# EAGLE schematic nixie2 (EAGLE 6.5.0)
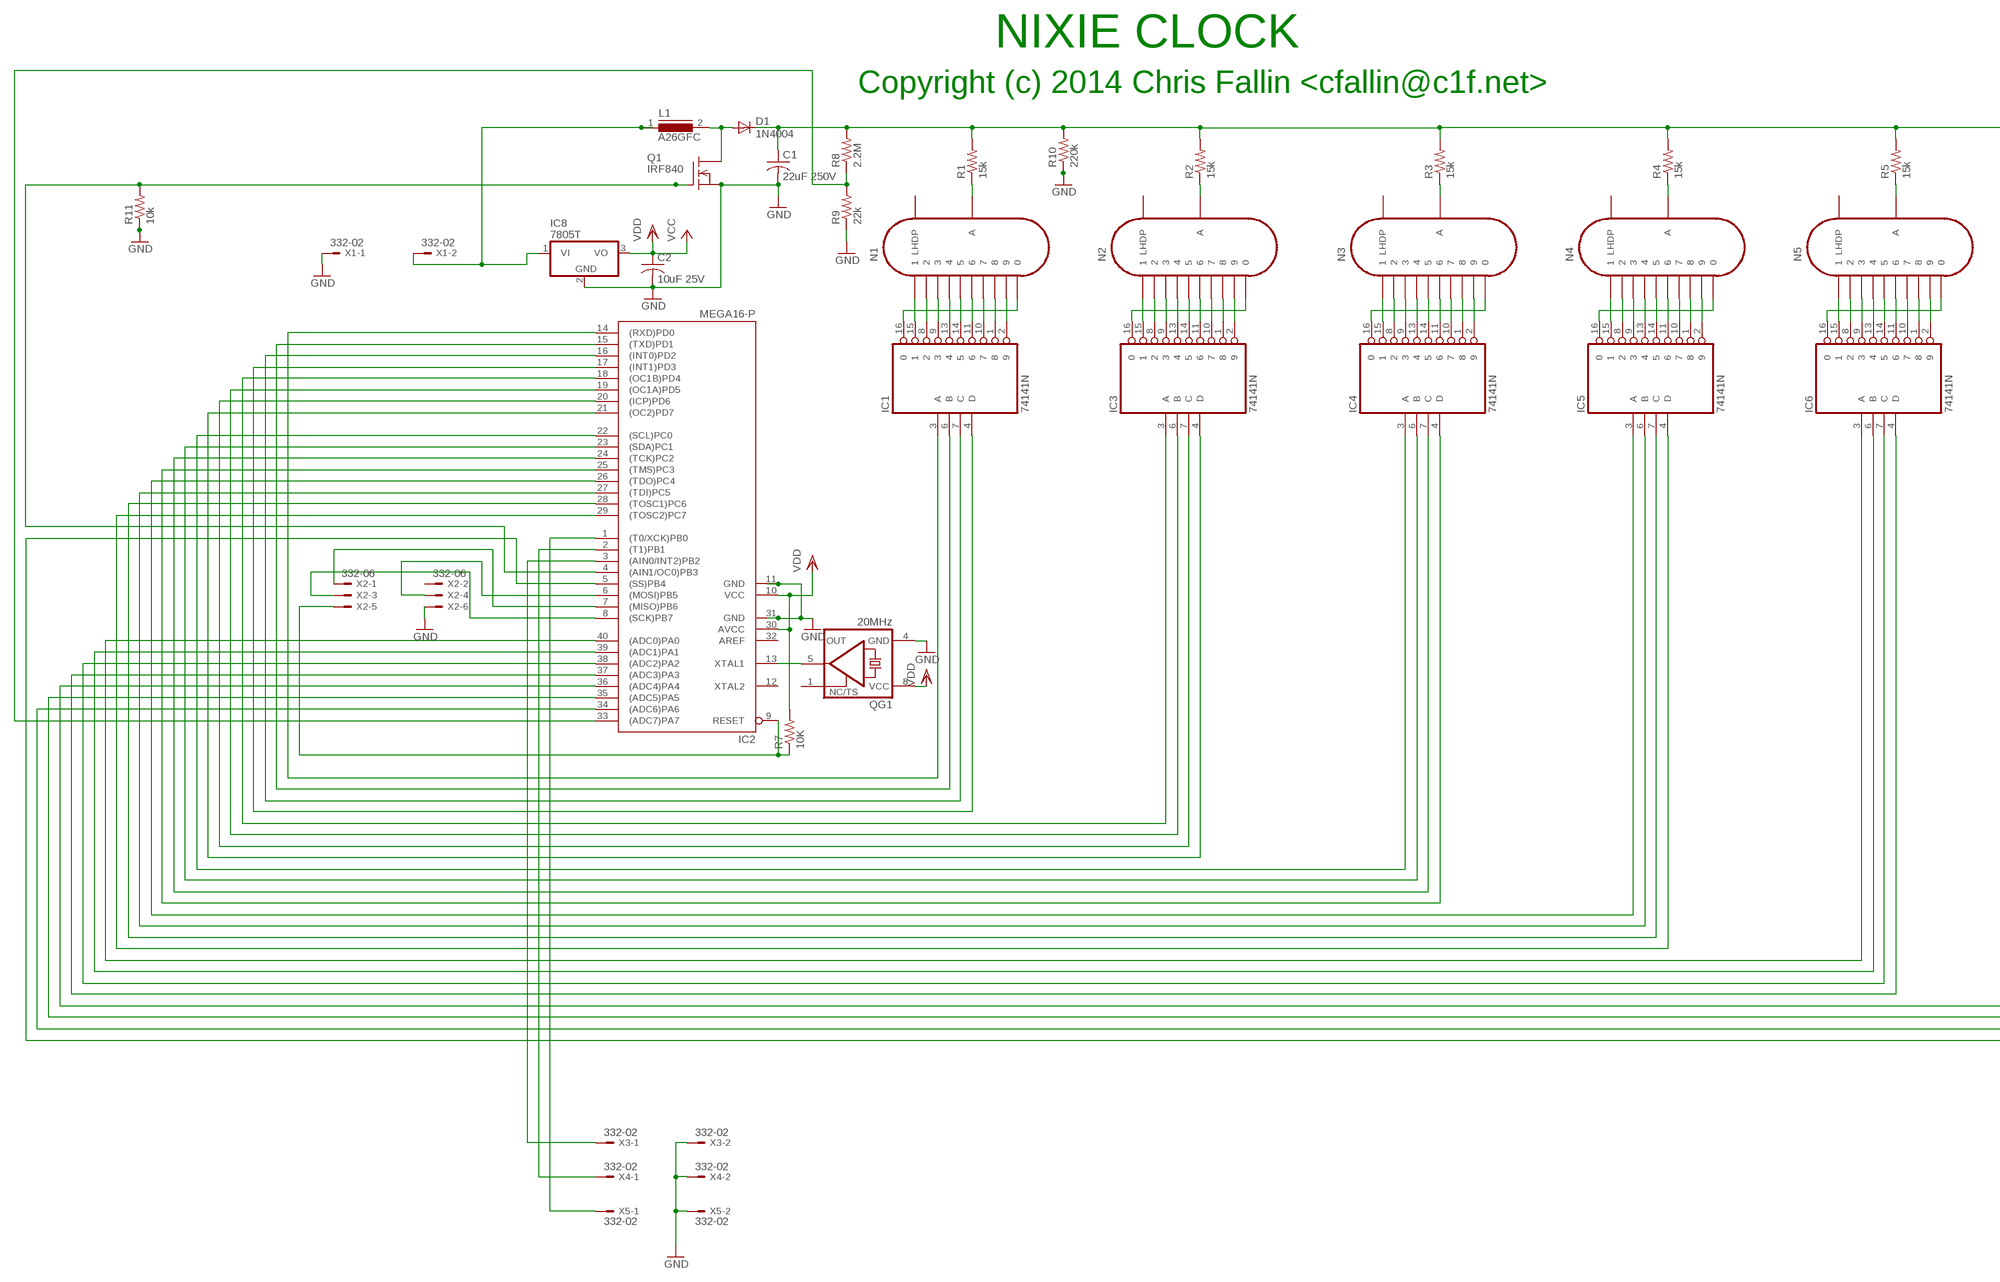
[diagram p0: schematic, sheet 1, part 1 of 2]
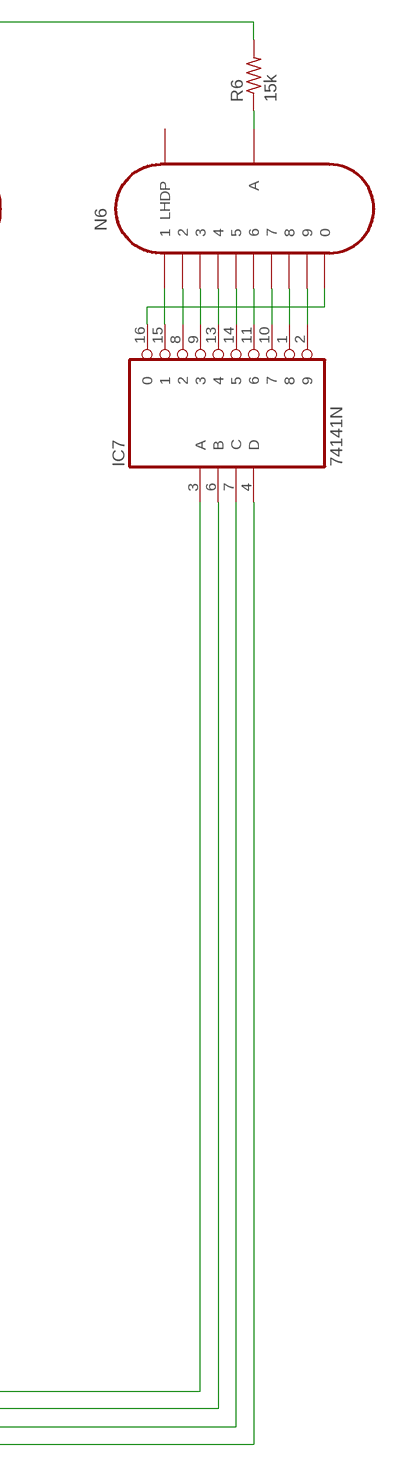
[diagram p1: schematic, sheet 1, part 2 of 2]

## Parts
C1  22uF 250V  C-US050-075X075  [C050-075X075]
C2  10uF 25V  C-US050-075X075  [C050-075X075]
D1  1N4004  [DO41-10]
IC1  74141N  [DIL16]
IC2  MEGA16-P  [DIL40]
IC3  74141N  [DIL16]
IC4  74141N  [DIL16]
IC5  74141N  [DIL16]
IC6  74141N  [DIL16]
IC7  74141N  [DIL16]
IC8  7805T  [TO220H]
L1  A26GFC  [A26GFC]
N1  IN-12B  [IN-12]
N2  IN-12B  [IN-12]
N3  IN-12B  [IN-12]
N4  IN-12B  [IN-12]
N5  IN-12B  [IN-12]
N6  IN-12B  [IN-12]
Q1  IRF840  [TO220]
QG1  20MHz  XO-8  [DIL08S]
R1  15k  R-US_0204/2V  [0204V]
R2  15k  R-US_0204/2V  [0204V]
R3  15k  R-US_0204/2V  [0204V]
R4  15k  R-US_0204/2V  [0204V]
R5  15k  R-US_0204/2V  [0204V]
R6  15k  R-US_0204/2V  [0204V]
R7  10K  R-US_0204/2V  [0204V]
R8  2.2M  R-US_0204/2V  [0204V]
R9  22k  R-US_0204/2V  [0204V]
R10  220k  R-US_0204/2V  [0204V]
R11  10k  R-US_0204/2V  [0204V]
X1  332-02  [332-02]
X2  332-06  [332-06]
X3  332-02  [332-02]
X4  332-02  [332-02]
X5  332-02  [332-02]

## Nets
GND: C1.2 C2.2 IC2.11(GND) IC2.31(GND) IC8.2(GND) Q1.3(S) QG1.4(GND) R9.1 R10.1 R11.1 X1.1 X2.6 X3.2 X4.2 X5.2
N$1: IC1.15 N1.1
N$2: IC1.8 N1.2
N$3: IC1.9 N1.3
N$4: IC1.13 N1.4
N$5: IC1.14 N1.5
N$6: IC1.11 N1.6
N$7: IC1.10 N1.7
N$8: IC1.1 N1.8
N$9: IC1.2 N1.9
N$11: N1.A R1.1
N$12: IC3.15 N2.1
N$13: IC3.8 N2.2
N$14: IC3.9 N2.3
N$15: IC3.13 N2.4
N$16: IC3.14 N2.5
N$17: IC3.11 N2.6
N$18: IC3.10 N2.7
N$19: IC3.1 N2.8
N$20: IC3.2 N2.9
N$21: IC3.16 N2.0
N$22: N2.A R2.1
N$23: IC4.15 N3.1
N$24: IC4.8 N3.2
N$25: IC4.9 N3.3
N$26: IC4.13 N3.4
N$27: IC4.14 N3.5
N$28: IC4.11 N3.6
N$29: IC4.10 N3.7
N$30: IC4.1 N3.8
N$31: IC4.2 N3.9
N$32: IC4.16 N3.0
N$33: N3.A R3.1
N$34: IC5.15 N4.1
N$35: IC5.8 N4.2
N$36: IC5.9 N4.3
N$37: IC5.13 N4.4
N$38: IC5.14 N4.5
N$39: IC5.11 N4.6
N$40: IC5.10 N4.7
N$41: IC5.1 N4.8
N$42: IC5.2 N4.9
N$43: IC5.16 N4.0
N$44: N4.A R4.1
N$45: IC6.15 N5.1
N$46: IC6.8 N5.2
N$47: IC6.9 N5.3
N$48: IC6.13 N5.4
N$49: IC6.14 N5.5
N$50: IC6.11 N5.6
N$51: IC6.10 N5.7
N$52: IC6.1 N5.8
N$53: IC6.2 N5.9
N$54: IC6.16 N5.0
N$55: N5.A R5.1
N$56: IC7.15 N6.1
N$57: IC7.8 N6.2
N$58: IC7.9 N6.3
N$59: IC7.13 N6.4
N$60: IC7.14 N6.5
N$61: IC7.11 N6.6
N$62: IC7.10 N6.7
N$63: IC7.1 N6.8
N$64: IC7.2 N6.9
N$65: IC7.16 N6.0
N$66: N6.A R6.1
N$67: C1.1 D1.C R1.2 R2.2 R3.2 R4.2 R5.2 R6.2 R8.2 R10.2
N$68: IC2.13(XTAL1) QG1.5(OUT)
N$69: IC2.6((MOSI)PB5) X2.4
N$70: D1.A L1.2 Q1.2(D)
N$71: IC8.1(VI) L1.1 X1.2
N$72: IC2.7((MISO)PB6) X2.1
N$73: IC2.8((SCK)PB7) X2.3
N$74: IC2.9(RESET) R7.1 X2.5
N$75: IC1.3(A) IC2.14((RXD)PD0)
N$76: IC1.6(B) IC2.15((TXD)PD1)
N$77: IC1.7(C) IC2.16((INT0)PD2)
N$78: IC1.4(D) IC2.17((INT1)PD3)
N$79: IC2.18((OC1B)PD4) IC3.3(A)
N$80: IC2.19((OC1A)PD5) IC3.6(B)
N$81: IC2.20((ICP)PD6) IC3.7(C)
N$82: IC2.21((OC2)PD7) IC3.4(D)
N$83: IC2.22((SCL)PC0) IC4.3(A)
N$84: IC2.23((SDA)PC1) IC4.6(B)
N$85: IC2.24((TCK)PC2) IC4.7(C)
N$86: IC2.25((TMS)PC3) IC4.4(D)
N$87: IC2.26((TDO)PC4) IC5.3(A)
N$88: IC2.27((TDI)PC5) IC5.6(B)
N$89: IC2.28((TOSC1)PC6) IC5.7(C)
N$90: IC2.29((TOSC2)PC7) IC5.4(D)
N$91: IC2.4((AIN1/OC0)PB3) Q1.1(G) R11.2
N$92: IC2.40((ADC0)PA0) IC6.3(A)
N$93: IC2.39((ADC1)PA1) IC6.6(B)
N$94: IC2.38((ADC2)PA2) IC6.7(C)
N$95: IC2.37((ADC3)PA3) IC6.4(D)
N$96: IC2.36((ADC4)PA4) IC7.3(A)
N$97: IC2.35((ADC5)PA5) IC7.6(B)
N$98: IC2.34((ADC6)PA6) IC7.7(C)
N$99: IC2.5((SS)PB4) IC7.4(D)
N$100: IC2.33((ADC7)PA7) R8.1 R9.2
N$101: IC2.3((AIN0/INT2)PB2) X3.1
N$102: IC2.2((T1)PB1) X4.1
N$103: IC2.1((T0/XCK)PB0) X5.1
N$105: IC1.16 N1.0
VDD: C2.1 IC2.10(VCC) IC2.30(AVCC) IC8.3(VO) QG1.8(VCC) R7.2 ; supply symbol labelled VCC
Unconnected: IC2.12(XTAL2) IC2.32(AREF) N1.LHDP N2.LHDP N3.LHDP N4.LHDP N5.LHDP N6.LHDP QG1.1(TS) X2.2

## Notes on the sheet
- NIXIE CLOCK
- Copyright (c) 2014 Chris Fallin <cfallin@c1f.net>

## Power pins joined to a net without a drawn wire
GND: IC1.12(GND) IC3.12(GND) IC4.12(GND) IC5.12(GND) IC6.12(GND) IC7.12(GND)
VCC: IC1.5(VCC) IC3.5(VCC) IC4.5(VCC) IC5.5(VCC) IC6.5(VCC) IC7.5(VCC)

## Library data of the parts
C1 C2 = rcl:C-US: CAPACITOR, American symbol
D1 = diode:1N4004: DIODE general purpose rectifier, 1 A
IC1 IC3-IC7 = 74xx-us:74*141: BCD to decimal DECODER/DRIVER
IC2 = atmel:MEGA16-P: MICROCONTROLLER 16 Kbytes FLASH 1 kbytes SRAM 512 bytes EEPROM USART 8-channel 10 bit ADC Source: avr.lbr; MPN: ATMEGA16-16PU; OC_FARNELL: 9171142; OC_NEWARK: 01M6885
IC8 = linear:78*: Positive VOLTAGE REGULATOR Source: http://cache.national.com/ds/LM/LM78L05.pdf http://www.fairchildsemi.com/ds/LM/LM7805.pdf
L1 = inductors:A26GFC: INDUCTOR
N1-N6 = russian-nixies:IN-12B: IN-12B: medium numeric topview nixie tube
Q1 = transistor-fet:IRF840: N-Channel Enhancement MOSFET (HEXFET); 500V; 8A; 0,85Ohm
QG1 = crystal:XO-: CRYSTAL; OC_FARNELL: unknown; OC_NEWARK: unknown
R1-R11 = rcl:R-US_: RESISTOR, American symbol
X1 X3-X5 = con-garry:332-02: 2 Pin - 2mm Dual Row Source: www.mpe-connector.de / garry_shortform_2012.pdf
X2 = con-garry:332-06: 6 Pin - 2mm Dual Row Source: www.mpe-connector.de / garry_shortform_2012.pdf